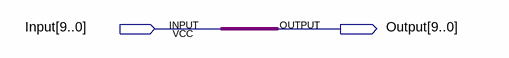
[diagram p0: schematic sheet]
// Quartus schematic glu_Logic.bdf as structural Verilog: 0 symbols, 2 pins
module glu_Logic (
  input  [9:0] Input,
  output [9:0] Output
);


  assign Output = Input;
endmodule
